# EAGLE design ArtNet_DMX_Controller (EAGLE 7.3.0)
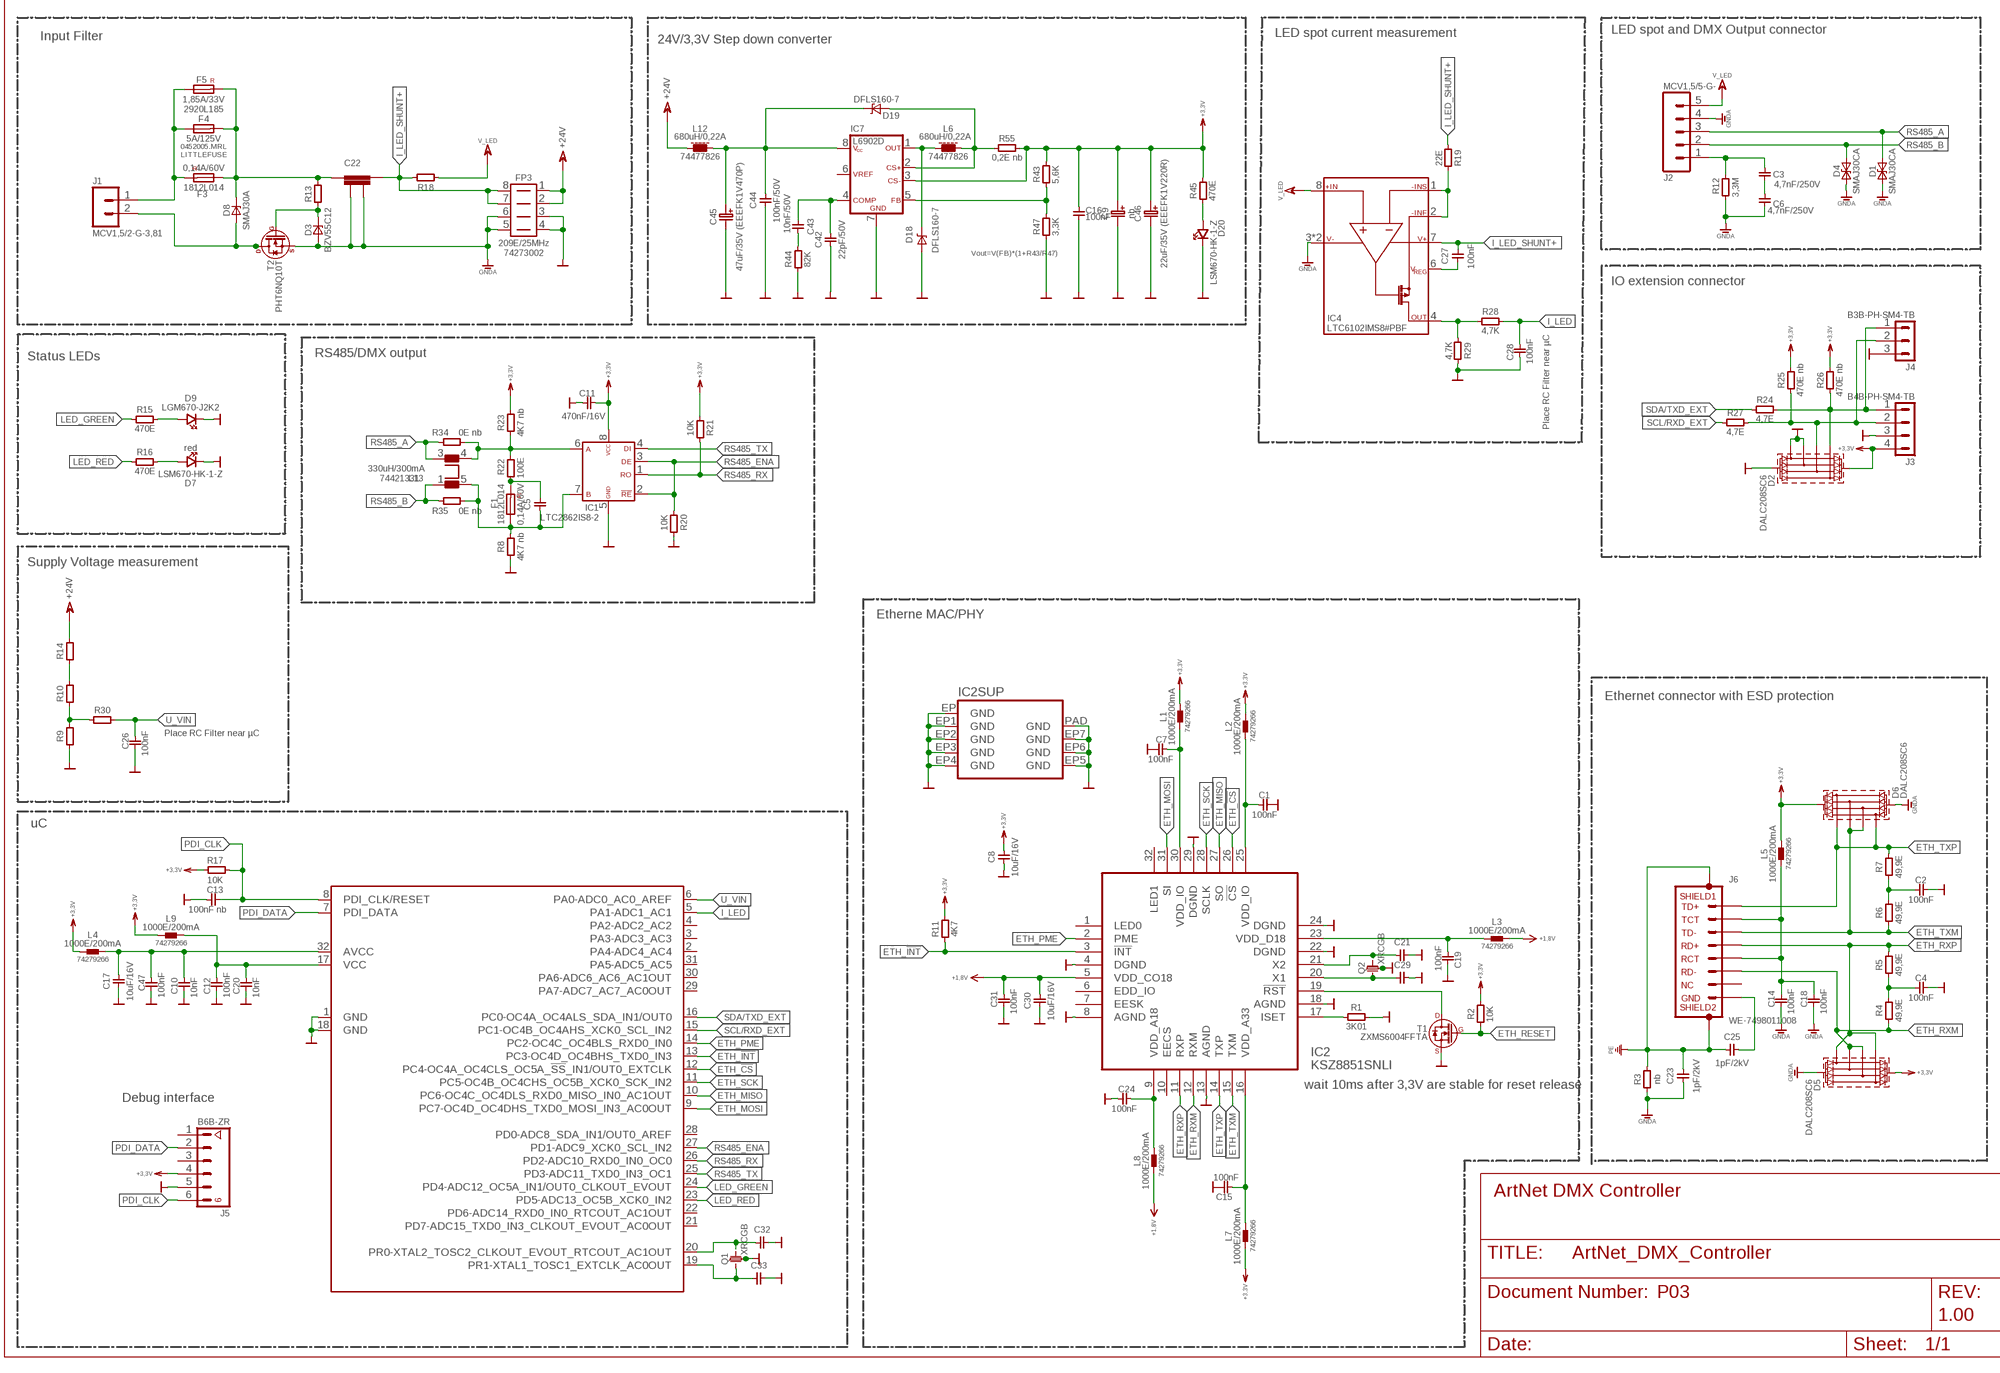
[diagram p0: schematic, sheet 1, part 1 of 2]
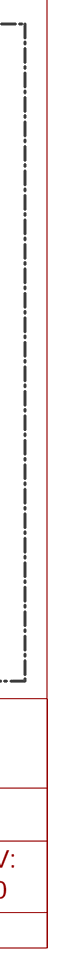
[diagram p1: schematic, sheet 1, part 2 of 2]

## Parts
C1  100nF  C-0603  [0603]
C2  100nF  C-0603  [0603]
C3  4,7nF/250V  C-2220  [2220]
C4  100nF  C-0603  [0603]
C5  C-0805  [0805]
C6  4,7nF/250V  C-2220  [2220]
C7  100nF  C-0603  [0603]
C8  10uF/16V  C-0805  [0805]
C9  nb  TANTAL-6032  [6032]
C10  10nF  C-0603  [0603]
C11  470nF/16V  C-0603  [0603]
C12  100nF  C-0603  [0603]
C13  100nF nb  C-0603  [0603]
C14  100nF  C-0603  [0603]
C15  100nF  C-0603  [0603]
C16  100nF  C-0603  [0603]
C17  10uF/16V  C-0805  [0805]
C18  100nF  C-0603  [0603]
C19  100nF  C-0603  [0603]
C20  10nF  C-0603  [0603]
C21  C-0603  [0603]
C22  NFM55P  [NFM55P]
C23  1pF/2kV  C-1206  [1206]
C24  100nF  C-0603  [0603]
C25  1pF/2kV  C-1206  [1206]
C26  100nF  C-0603  [0603]
C27  100nF  C-0805  [0805]
C28  100nF  C-0603  [0603]
C29  C-0603  [0603]
C30  10uF/16V  C-0805  [0805]
C31  100nF  C-0603  [0603]
C32  C-0603  [0603]
C33  C-0603  [0603]
C42  22pF/50V  C-0603  [0603]
C43  10nF/50V  C-0603  [0603]
C44  100nF/50V  C-0805  [0805]
C45  47uF/35V (EEEFK1V470P)  ELKO-PANSIZE-D  [PANASONIC-SIZE-CODE-D]
C46  22uF/35V (EEEFK1V220R)  ELKO-PANSIZE-D  [PANASONIC-SIZE-CODE-D]
C47  100nF  C-0603  [0603]
D1  SMAJ30CA  [DO-214AC]
D2  DALC208SC6  [SOT23-6L]
D3  BZV55C12  [SOD80C]
D4  SMAJ30CA  [DO-214AC]
D5  DALC208SC6  [SOT23-6L]
D6  DALC208SC6  [SOT23-6L]
D7  LSM670-HK-1-Z  [M670]
D8  SMAJ30A  [DO-214AC]
D9  LGM670-J2K2  [M670]
D18  DFLS160-7  [POWERDI123]
D19  DFLS160-7  [POWERDI123]
D20  LSM670-HK-1-Z  [M670]
F1  0,14A/60V  1812L014  [1812L]
F3  0,14A/60V  1812L014  [1812L]
F4  5A/125V  0452005.MRL  [6.1X2.69MM]
F5  1,85A/33V  2920L185  [2920L]
FP3  209E/25MHz  WE-MLS-209E/25MHZ-10,88MMX5,49MM  [WE-MLS-10,88MMX5,49MM]
IC1  LTC2862IS8-2  [SO8]
IC2  KSZ8851SNLI  IC_KSZ8851SNL  [QFN32_5X5]
IC3  E5-TQFP  [TQFP32]
IC4  LTC6102IMS8#PBF  [MS8]
IC7  L6902D  [SO8]
J1  MCV1,5/2-G-3,81  [MCV1,5/2-G-3,81]
J2  MCV1,5/5-G-  [MCV1,5/5-G-3,81_MOD]
J3  B4B-PH-SM4-TB  [B4B-PH-SM4-TB]
J4  B3B-PH-SM4-TB  [B3B-PH-SM4-TB]
J5  B6B-ZR  [B6B-ZR]
J6  WE-7498011008  [WE-749801108]
L1  1000E/200mA  WE-CBF-1000E/200MA-0603  [0603]
L2  1000E/200mA  WE-CBF-1000E/200MA-0603  [0603]
L3  1000E/200mA  WE-CBF-1000E/200MA-0603  [0603]
L4  1000E/200mA  WE-CBF-1000E/200MA-0603  [0603]
L5  1000E/200mA  WE-CBF-1000E/200MA-0603  [0603]
L6  680uH/0,22A  WE-PD-680UH/0,22A-7332  [73XX]
L7  1000E/200mA  WE-CBF-1000E/200MA-0603  [0603]
L8  1000E/200mA  WE-CBF-1000E/200MA-0603  [0603]
L9  1000E/200mA  WE-CBF-1000E/200MA-0603  [0603]
L12  680uH/0,22A  WE-PD-680UH/0,22A-7332  [73XX]
L13  330uH/300mA  WE-SL1-330UH/300MA  [WE-SL1]
Q1  XRCGB  [XRCGB]
Q2  XRCGB  [XRCGB]
R1  3K01  R-0603  [0603]
R2  10K  R-0603  [0603]
R3  nb  R-1206  [1206]
R4  49,9E  R-0603  [0603]
R5  49,9E  R-0603  [0603]
R6  49,9E  R-0603  [0603]
R7  49,9E  R-0603  [0603]
R8  4K7 nb  R-0805  [0805]
R9  R-0603  [0603]
R10  R-0603  [0603]
R11  4K7  R-0603  [0603]
R12  3,3M  R-0207  [0207]
R13  R-0805  [0805]
R14  R-0603  [0603]
R15  470E  R-0603  [0603]
R16  470E  R-0603  [0603]
R17  10K  R-0603  [0603]
R18  R-2512  [2512]
R19  22E  R-0603  [0603]
R20  10K  R-0603  [0603]
R21  10K  R-0603  [0603]
R22  100E  R-0207  [0207]
R23  4K7 nb  R-0805  [0805]
R24  4,7E  R-0603  [0603]
R25  470E nb  R-0603  [0603]
R26  470E nb  R-0603  [0603]
R27  4,7E  R-0603  [0603]
R28  4,7K  R-0603  [0603]
R29  4,7K  R-0603  [0603]
R30  R-0603  [0603]
R34  0E nb  R-0805  [0805]
R35  0E nb  R-0805  [0805]
R43  5,6K  R-0603  [0603]
R44  82K  R-0603  [0603]
R45  470E  R-0603  [0603]
R47  3,3K  R-0603  [0603]
R55  0,2E nb  R-0805  [0805]
T1  ZXMS6004FFTA  [SOT-23]
T2  PHT6NQ10T  [SOT223]

## Nets
+1,8V: C30.2 C31.2 IC2.5(VDD_CO18) L3.2 L8.1
+3,3V: C8.1 C9.PLUS(+) C11.2 C16.2 C46.+ D2.2(REF2) D5.2(REF2) D6.2(REF2) IC1.8(VCC) IC7.3(CS-) J3.4 J5.4 L1.2 L2.2 L4.1 L5.2 L7.1 L9.1 R2.2 R11.2 R17.2 R21.2 R23.2 R25.2 R26.2 R43.2 R45.2 R55.2
+24V: FP3.1 FP3.2 L12.1 R14.2
AVCC: C10.2 C17.2 C47.2 IC3.32(AVCC) L4.2
BLA: C5.1 F1.1 IC1.7(B) L13.5 R8.2 R35.2
BLA2: IC1.6(A) L13.4 R22.2 R23.1 R34.2
ETH_!CS: IC2.26(!CS) IC3.12(PC4-OC4A_OC4CLS_OC5A_!SS!_IN1/OUT0_EXTCLK)
ETH_!INT: IC2.3(!INT) IC3.13(PC3-OC4D_OC4BHS_TXD0_IN3) R11.1
ETH_MISO: IC2.27(SO) IC3.10(PC6-OC4C_OC4DLS_RXD0_MISO_IN0_AC1OUT)
ETH_MOSI: IC2.31(SI) IC3.9(PC7-OC4D_OC4DHS_TXD0_MOSI_IN3_AC0OUT)
ETH_PME: IC2.2(PME) IC3.14(PC2-OC4C_OC4BLS_RXD0_IN0)
ETH_RESET: R2.1 T1.1(G)
ETH_RXM: D5.3(I/O2) D5.4(I/O3) IC2.12(RXM) J6.P$6(RD-) R4.1
ETH_RXP: D5.1(I/O1) D5.6(I/O4) IC2.11(RXP) J6.P$3(RD+) R5.2
ETH_SCK: IC2.28(SCLK) IC3.11(PC5-OC4B_OC4CHS_OC5B_XCK0_SCK_IN2)
ETH_TXM: D6.3(I/O2) D6.4(I/O3) IC2.15(TXM) J6.P$2(TD-) R6.1
ETH_TXP: D6.1(I/O1) D6.6(I/O4) IC2.14(TXP) J6.P$1(TD+) R7.2
GND: C1.2 C2.2 C4.2 C7.2 C8.2 C9.MINUS(-) C10.1 C11.1 C12.1 C13.2 C15.2 C16.1 C17.1 C19.2 C20.1 C21.2 C24.1 C26.1 C28.1 C29.2 C30.1 C31.1 C32.2 C33.2 C42.1 C44.1 C45.- C46.- C47.1 D2.1(I/O1) D2.3(I/O2) D2.5(REF1) D7.K D9.K D18.A D20.K FP3.3 FP3.4 IC1.5(GND) IC2.4(DGND) IC2.8(AGND) IC2.13(AGND) IC2.18(AGND) IC2.22(DGND) IC2.24(DGND) IC2.29(DGND) IC2.EP1(GND) IC2.EP2(GND) IC2.EP3(GND) IC2.EP4(GND) IC2.EP5(GND) IC2.EP6(GND) IC2.EP7(GND) IC2.EP(GND) IC2.PAD(GND) IC3.1(GND) IC3.18(GND) IC7.7(GND) J3.3 J4.3 J5.5 Q1.3 Q1.4 Q2.3 Q2.4 R1.2 R8.1 R9.1 R20.1 R29.2 R44.1 R47.1 T1.2(S)
GNDA: C6.P$1 C14.1 C18.1 C22.3 C22.4 C23.1 D1.K D3.A D4.K D5.5(REF1) D6.5(REF1) FP3.5 FP3.6 IC4.3(V-) IC4.5(V-) J2.4 R3.1 R12.1 T2.3(S)
I_LED: C28.2 IC3.5(PA1-ADC1_AC1) R28.2
I_LED_SHUNT+: C22.2 C27.2 FP3.7 FP3.8 IC4.7(V+) R18.2 R19.1
LED_GREEN: IC3.24(PD4-ADC12_OC5A_IN1/OUT0_CLKOUT_EVOUT) R15.1
LED_RED: IC3.23(PD5-ADC13_OC5B_XCK0_IN2) R16.1
N$1: IC2.17(ISET) R1.1
N$2: C3.P$2 J2.1 R12.2
N$3: IC2.19(!RST) T1.3(D)
N$4: C7.1 IC2.30(VDD_IO) L1.1
N$5: C1.1 IC2.25(VDD_IO) L2.1
N$6: C5.2 F1.2 R22.1
N$7: D3.K R13.1 T2.1(G)
N$8: C27.1 IC4.6(VREG)
N$9: C3.P$1 C6.P$2
N$10: C25.2 J6.P$8(GND)
N$11: D9.A R15.2
N$12: D7.A R16.2
N$13: C29.1 IC2.20(X1) Q2.1
N$14: C32.1 IC3.20(PR0-XTAL2_TOSC2_CLKOUT_EVOUT_RTCOUT_AC1OUT) Q1.2
N$15: F3.2 F4.1 F5.1 J1.1
N$16: C33.1 IC3.19(PR1-XTAL1_TOSC1_EXTCLK_AC0OUT) Q1.1
N$17: R10.2 R14.1
N$18: IC4.4(OUT) R28.1 R29.1
N$19: C22.1 D8.K F3.1 F4.2 F5.2 R13.2
N$20: C15.1 IC2.16(VDD_A33) L7.2
N$21: R9.2 R10.1 R30.1
N$22: D2.6(I/O4) J3.1 J4.1 R24.2 R26.1
N$23: C21.1 IC2.21(X2) Q2.2
N$24: D2.4(I/O3) J3.2 J4.2 R25.1 R27.2
N$25: C14.2 C18.2 J6.P$4(TCT) J6.P$5(RCT) L5.1
N$26: C2.1 R6.2 R7.1
N$27: C24.2 IC2.9(VDD_A18) L8.2
N$28: D8.A J1.2 T2.2(D) T2.4(D1)
N$29: C4.1 R4.2 R5.1
N$30: IC4.1(-INS) IC4.2(-INF) R19.2
N$38: IC7.5(FB) R43.1 R47.2
N$39: D19.A IC7.2(CS+) L6.2 R55.1
N$59: D18.K IC7.1(OUT) L6.1
N$62: C42.2 C43.1 IC7.4(COMP)
N$63: C43.2 R44.2
N$65: D20.A R45.1
N$67: C44.2 C45.+ D19.K IC7.8(VCC) L12.2
PDI_CLK: C13.1 IC3.8(PDI_CLK/RESET) J5.6 R17.1
PDI_DATA: IC3.7(PDI_DATA) J5.2
PE: C23.2 C25.1 J6.P$9 J6.P$10 R3.2
RS485_A: D1.A J2.3 L13.3 R34.1
RS485_B: D4.A J2.2 L13.1 R35.1
RS485_ENA: IC1.2(/RE) IC1.3(DE) IC3.27(PD1-ADC9_XCK0_SCL_IN2) R20.2
RS485_RX: IC1.1(R0) IC3.26(PD2-ADC10_RXD0_IN0_OC0) R21.1
RS485_TX: IC1.4(DI) IC3.25(PD3-ADC11_TXD0_IN3_OC1)
SCL/RXD_EXT: IC3.15(PC1-OC4B_OC4AHS_XCK0_SCL_IN2) R27.1
SDA/TXD_EXT: IC3.16(PC0-OC4A_OC4ALS_SDA_IN1/OUT0) R24.1
U_VIN: C26.2 IC3.6(PA0-ADC0_AC0_AREF) R30.2
V_LED: IC4.8(+IN) J2.5 R18.1
VCC: C12.2 C20.2 IC3.17(VCC) L9.2
VDD_D18: C19.1 IC2.23(VDD_D18) L3.1
Unconnected: IC2.1(LED0) IC2.6(EDD_IO) IC2.7(EESK) IC2.10(EECS) IC2.32(LED1) IC3.2(PA4-ADC4_AC4) IC3.3(PA3-ADC3_AC3) IC3.4(PA2-ADC2_AC2) IC3.21(PD7-ADC15_TXD0_IN3_CLKOUT_EVOUT_AC0OUT) IC3.22(PD6-ADC14_RXD0_IN0_RTCOUT_AC1OUT) IC3.28(PD0-ADC8_SDA_IN1/OUT0_AREF) IC3.29(PA7-ADC7_AC7_AC0OUT) IC3.30(PA6-ADC6_AC6_AC1OUT) IC3.31(PA5-ADC5_AC5) IC7.6(VREF) J5.1 J5.3 J6.P$7(NC)

## Notes on the sheet
- LED spot current measurement | LED spot and DMX Output connector
- Input Filter | 24V/3,3V Step down converter
- Vout=V(FB)*(1+R43/R47)
- IO extension connector
- Place RC Filter near µC
- Status LEDs | RS485/DMX output
- Supply Voltage measurement
- Etherne MAC/PHY
- Ethernet connector with ESD protection
- Place RC Filter near µC
- uC
- wait 10ms after 3,3V are stable for reset release
- Debug interface
- ArtNet DMX Controller
- P03
- 1.00

## Library data of the parts
C1 C2 C4 C7 C10-C16 C18-C21 C24 C26 C28 C29 C31-C33 C42 C43 C47 = 110_PASSIV:C: PASSIVE - Bauelement C; HEIGHT: 0.3
C3 C6 = 110_PASSIV:C: PASSIVE - Bauelement C
C5 C8 C17 C23 C25 C27 C30 C44 = 110_PASSIV:C: PASSIVE - Bauelement C; HEIGHT: 0.85
C9 = 110_PASSIV:TANTAL
C22 = 110_PASSIV:NFM?: EMIFIL (Capacitor type) Single Circuit Type for Large Current Infos ID-number: S37144 ... ... Table of revision Date Name Description 20.09.2010 EBBE erstellt ... ... ... ... ... ...
C45 C46 = 110_PASSIV:ELKO: ALUMINUM ELECTROLYTIC CAPACITORS
D1 D4 = 100_DIODE:SMAJ*CA: Transient Voltage Suppressors - SMAJ Series Bild/ Picture Merkmale/ Features Low profile package Ideal for automated placement Excellent clamping capability 400W peak pulse power capability with a 10/1000µs waveform, repetitive rate (duty cycle): 0,01% (300W above 78V) Very fast response time Anwendungen/ Applications TVS devices are ideal for protection of I/O Interfaces, VCC bus and other vulnerable circuits used in Telecom, Computer, Industrial and Consumer electronic applications. Beschreibung/ Description The SMAJ series is designed specifically to protect sensitive electronic equipment from voltage transients induced by lightning and other transient voltage events. Link Datenblatt - Vishay <http://www.vishay.com/docs/88390/smaj50a.pdf> Datenblatt - Littelfuse <http://www.littelfuse.com/products/tvs-diodes/surface-mount/~/media/Electronics/Datasheets/TVS_Diodes/Littelfuse_TVS_Diode_SMAJ_Datasheet.pdf.pdf> Datenblatt - ST <http://www.st.com/st-web-ui/static/active/en/resource/technical/document/datasheet/CD00001333.pdf> EBBE, 27.11.2013; DE-ID: 47526; HEIGHT: 2,45; I_PP: 8,3A; V_BR-MAX: 36,8V; V_BR-MIN: 33,3V; V_CL: 48,4V
D2 D5 D6 = 100_DIODE:DALC208SC6: DALC208SC6 - low capacitance diode array (ESD) Manufacturer: ST Id: 52398 Features: protection of 4 lines peak reverse voltage: 9V per diode very low capacitance per diode: lower 5pF Main applications: sensitive logic input protection ISDN USB interface Networks SMAN (sman@diel.co.at) Updated 11/11/2009
D3 = 100_DIODE:BZ?55C*: BZV55: Features Non-repetitive peak reverse power dissipation: lower equal 40W Total power dissipation: lower equal 500mW Two tolerance series: +/-2% and +/-5% Wide working voltage range: nominal 2.4V to 75V (E24 range) Low differential resistance Small hermetically sealed glass SMD package Applications General regulation functions autor: EBBE BZM55: Features: Saving space Electrical data identical with the devices BZT55..Series / TZM..Series Fits onto SOD323/SOD110 footprints Very sharp reverse characteristic Low reverse current level Very high stability Low noise Available with tighter tolerances Lead (Pb)-free component Component in accordance to RoHS 2002/95/EC and WEEE 2002/96/EC Applications Voltage stabilization autor: EBBE
D7 D20 = 130_OPTIC:L?M670*: Mini TOPLED von SIEMENS Infos LSM670-HK-1-Z ROT clear S34264 LGM670-J2K2 GRÜN clear S34262 LPM670-H1J11 GRÜN S50228 LYM670-HK GELB S42944 --> abgekündigt! Alternative: 58419 LYM67K-K1L2 Table of revision Date Name Description ? LETI erstellt 29.04.2010 SMAN Description ... ... ...; COLOR: red; HEIGHT: 1,4
D8 = 100_DIODE:SMAJ*A: Transient Voltage Suppressors - SMAJ Series Bild/ Picture Merkmale/ Features Low profile package Ideal for automated placement Excellent clamping capability 400W peak pulse power capability with a 10/1000µs waveform, repetitive rate (duty cycle): 0,01% (300W above 78V) Very fast response time Anwendungen/ Applications TVS devices are ideal for protection of I/O Interfaces, VCC bus and other vulnerable circuits used in Telecom, Computer, Industrial and Consumer electronic applications. Beschreibung/ Description The SMAJ series is designed specifically to protect sensitive electronic equipment from voltage transients induced by lightning and other transient voltage events. Link Datenblatt - Vishay <http://www.vishay.com/docs/88390/smaj50a.pdf> Datenblatt - Littelfuse <http://www.littelfuse.com/products/tvs-diodes/surface-mount/~/media/Electronics/Datasheets/TVS_Diodes/Littelfuse_TVS_Diode_SMAJ_Datasheet.pdf.pdf> Datenblatt - ST <http://www.st.com/st-web-ui/static/active/en/resource/technical/document/datasheet/CD00001333.pdf> EBBE, 27.11.2013; DE-ID: 47526; HEIGHT: 2.3; I_PP: 8,3A; V_BR-MAX: 36,8V; V_BR-MIN: 33,3V; V_CL: 48,4V
D9 = 130_OPTIC:L?M670*: Mini TOPLED von SIEMENS Infos LSM670-HK-1-Z ROT clear S34264 LGM670-J2K2 GRÜN clear S34262 LPM670-H1J11 GRÜN S50228 LYM670-HK GELB S42944 --> abgekündigt! Alternative: 58419 LYM67K-K1L2 Table of revision Date Name Description ? LETI erstellt 29.04.2010 SMAN Description ... ... ...; COLOR: green; HEIGHT: 1,4
D18 D19 = 100_DIODE:DFLS160-7: 1.0A Surface Mount Schottky Barrier Rectifier Hersteller DIODES Reverse Voltage 70V Feature Guard Ring Die Construction for Transient Protection Low Power Loss, High Efficiency Patented Interlocking Clip Design for High Surge Current Capacity Lead-free Finish; RoHS Compliant (Notes 1&2) Green Molding Compound (No Br, Sb) Qualified to AEC-Q101 Standards for High Reliability PDF Datenblatt Herstellerseite Web <http://www.diodes.com/datasheets/ds30548.pdf> EBBE, 02.10.2012; HEIGHT: 1
F1 F3 = 150_FUSES:1812L*: 1812L Series < POLY-FUSE Resettable PTCs Bild/ Picture Merkmale/ Features RoHS compliant, lead-free and halogen-free Fast response Compact design Low resistance Low-profile Compatible with high temperature solders Anwendungen/ Applications --- Beschreibung/ Description The 1812L Series PTC provides surface mount overcurrent protection for applications where resettable protection is desired. Link Datenblatt <http://www.littelfuse.com/products/resettable-ptcs/surface-mount/~/media/Electronics/Datasheets/Resettable_PTCs/Littelfuse_PTC_1812L_Datasheet.pdf.pdf> EBBE, 27.11.2013 update LETI, 16.10.2014 (1812L014); DE-ID: 48868; HEIGHT: 1.95; MPN: 1812L014; RESISTANCE-MAX: 6E; RESISTANCE-MIN: 1,5E
F4 = 150_FUSES:0452*MRL: 452/454 Series < Slo-Blo < NANO² Bild/ Picture Merkmale/ Features Time-Lag (Slo-Blo) Small size Wide range of current rating available (375mA to 12A) Wide operating temperature range Low temperature de-rating RoHS compliant Halogen Free Anwendungen/ Applications --- Beschreibung/ Description The NANO² Slo-Blo fuse has enhanced inrush withstand chracteristics over the NANO² Fast-Acting fuse. The unique time delay feature of this fuse design helps solve the problem of nuisance "opening" by accommodating inrush currents that normaly cause a fast-acting fuse to open. Link Datenblatt <http://www.littelfuse.com/products/fuses/surface-mount-fuses/nano-2-fuses/~/media/Electronics/Datasheets/Fuses/Littelfuse_Fuse_452_454_Datasheet.pdf.pdf> - 452/454 Series EBBE, 25.11.2013; DE-ID: 74866; MF: LITTLEFUSE; MPN: 0452005.MRL; NOMINAL-MELTING: 53,72A²sec; RESISTANCE: 0,0136E
F5 = 150_FUSES:2920L*: 2920L Series < POLY-FUSE Resettable PTCs Bild/ Picture Merkmale/ Features RoHS compliant, lead-free and halogen-free Fast response to fault currents High voltage Low-profile Anwendungen/ Applications --- Beschreibung/ Description The 2920L Series PTC provides surface mount overcurrent protection for medium voltage (≤60V) applications where resettable protection is desired. Link Datenblatt <http://www.littelfuse.com/~/media/electronics/datasheets/resettable_ptcs/littelfuse_ptc_2920l_datasheet.pdf.pdf> EBBE, 25.11.2013; DE-ID: 45675; HEIGHT: 1.25; MPN: 2920L185; RESISTANCE-MAX: 0,15E; RESISTANCE-MIN: 0,05E; RESISTANCE-TYP: 0,11E
FP3 = 220_WUERTH:WE-MLS: WE-MLS Ferritbrücke Bild/ Picture Merkmale/ Features Zweifach stromkempensierte Drossel durch Verschaltung zu 2x2 Windungen erzeugbar Hohe Strombelastbarkeit von typ. 4A Breitbandige Filterwirkung durch NiZn-Absorberferritkern HF-Gleichtaktdrossel für 2, 3 bzw. 4 Leitungen in einem Bauteil Durch entsprechende Layoutgestaltung lässt sich Impedanz (z.B. 4 Windungen) bzw. Strom erhöhen (Parallelschaltung) Betriebstemperatur: –55 °C bis +125 °C Kundenspezifische Ausführungen auf Anfrage Anwendungen/ Applications Hervorragend geeignet zur Absorption von Gleich- und Gegentaktstörungen Bei einfacher Durchführung entsteht für das Signal eine stromkompensierte 3- bzw. 4- fach-Drossel Mehrleitersysteme und Leistungselektronik Befilterung von Kleinspannungsnetzteilen 4- Leiter Sensorik Beschreibung/ Description --- Link Datenblatt <http://katalog.we-online.de/de/pbs/WE-MLS> EBBE, 21.10.2013; DE-ID: 87706; MPN: 74273002; Z-100MHZ: 249E
IC1 = 260_LINEAR_TECHNOLOGY:LTC2862*?-2: ±60V Fault Protected 3V to 5.5V RS485/RS422 Transceivers Bild/ Picture Merkmale/ Features Protected from Overvoltage Line Faults to ±60V 3V to 5.5V Supply Voltage 20Mbps or Low EMI 250kbps Data Rate ±15kV ESD Interface Pins, ±8kV All Other Pins Extended Common Mode Range: ±25V Guaranteed Failsafe Receiver Operation High Input Impedance Supports 256 Nodes 1.65V to 5.5V Logic Supply Pin (VL) for Flexible Digital Interface (LTC2865) MP-Grade Option Available (–55°C to 125°C) Fully Balanced Differential Receiver Thresholds for Low Duty Cycle Distortion Current Limited Drivers and Thermal Shutdown Pin Compatible with LT1785 and LT1791 Available in DFN and Leaded Packages Anwendungen/ Applications Supervisory Control and Data Acquisition (SCADA) Industrial Control and Instrumentation Networks Automotive and Transportation Electronics Building Automation, Security Systems and HVAC Medical Equipment Lighting and Sound System Control Beschreibung/ Description The LT C®2862/LTC2863/LTC2864/LTC2865 are low power, 20Mbps or 250kbps RS485/RS422 transceivers operating on 3V to 5.5V supplies that feature ±60V overvoltage fault protection on the data transmission lines during all modes of operation, including power-down. Low EMI slew rate limited data transmission is available in a logic-selectable 250kbps mode in the LTC2865 and in 250kbps versions of the LTC2862-LTC2864. Enhanced ESD protection allows these parts to withstand ±15kV HBM on the transceiver interface pins without latchup or damage. Extended ±25V input common mode range and full fail- safe operation improve data communication reliability in electrically noisy environments and in the presence of large ground loop voltages. Link Datenblatt <http://cds.linear.com/docs/en/datasheet/2862345fb.pdf> update LETI, 18.03.2014; HEIGHT: 1.752; HERSTELLER: Liniar Technology; ID: 91903; K: S; MPN: LTC2862IS8-2#TRPBF
IC2 = dp_devices:IC_KSZ8851SNL: Fast Ethernet Controller with PHY, MAC and SPI
IC3 = e5:E5
IC4 = 260_LINEAR_TECHNOLOGY:LTC6102*?#PBF: Precision Zero Drift Current Sense Amplifier Merkmale/ Features Supply Range: 4V to 60V, 70V Maximum (LTC6102) 5V to 100V, 105V Maximum (LTC6102HV) ±10µV Input Offset Maximum ±50nV/°C Input Offset Drift Maximum Fast Response: 1µs Step Response Gain Configurable with Two Resistors Low Input Bias Current: 3nA Maximum PSRR 130dB Minimum Output Currents up to 1mA Operating Temperature Range: -40°C to 125°C Disable Mode (LTC6102-1 Only): 1µA Maximum Available in 8-Lead MSOP and 3mm x 3mm DFN Packages Anwendungen/ Applications Current Shunt Measurement Battery Monitoring Remote Sensing Load Protection Motor Control Automotive Controls Link Datenblatt <http://cds.linear.com/docs/en/datasheet/6102fe.pdf> EBBE, 04.06.2014; DE-ID: ---
IC7 = 120_AKTIV:L6902D: Up to 1A switching regulator with adjustable current limit Hersteller ST Microelectronics Feature Up to 1A output current Operating input voltage from 8V to 36V Precise 3,3V (+/-2%) reference voltage 5% output current accuracy Output voltage adjustable from 1.235V to 34V 250kHz internally fixed frequency Voltage feedforward Zero load current operation Adjustable current limit Protection against feedback Disconnection Thermal shutdown PDF Datenblatt Herstellerseite Web <http://www.st.com/internet/com/TECHNICAL_RESOURCES/TECHNICAL_LITERATURE/DATASHEET/CD00002179.pdf> EBBE, 08.02.2013
J1 = 370_PHOENIX:MCV1,5/2-G-3,81: 1803426 MCV 1,5/2-G-3,81 SMAN, 20.12.2012; HEIGHT: 9.2
J2 = 370_PHOENIX:MCV1,5/5-G-?: 5-polige Phoenix Buchse Infos Schlagwörter: Phoenix Buchse Id's: Fxxxxx Änderungsverzeichnis Date Name Description 07.03.2011 EBBE erstellt ... ... ... ... ... ...
J3 = 310_JST:?4B-PH-SM4*-TB: PH Connector Specifications Rastermaß: 2mm Current rating: 2.0A AC, DC (AWG #24) Voltage rating: 100V AC, DC Temperature range: -25°C to 85°C AWG #32 to #24 Id's B4B-PH-SM4-TB S44350 S4B-PH-SM4A-TB S35132 SPH-002T-P0.5S: F04117 (AWG #30 to #24) PHR-04: F04494 Autor: LETI
J4 = 310_JST:?3B-PH-SM4*-TB: PH Connector Specifications Rastermaß: 2mm Current rating: 2.0A AC, DC (AWG #24) Voltage rating: 100V AC, DC Temperature range: -25°C to 85°C AWG #32 to #24 Id's B3B-PH-SM4-TB: S25304 S3B-PH-SM4-TB: S52351 SPH-002T-P0.5S: F04117 (AWG #30 to #24) PHR-03: F16605 Autor: EBBE
J5 = 310_JST:?6B-ZR
J6 = RJ45:WE-7498011008
L1-L5 L7-L9 = 220_WUERTH:WE-CBF: WE-CBF SMD EMI Suppression Ferrite Bead Bild/ Picture Merkmale/ Features Hochwertige Ni-Sn Elektroden Sehr hohe Stromtragfähigkeit bis 6A Empfohlenes Lötverfahren: Reflow Betriebstemperatur: -55°C bis +125°C Anwendungen/ Applications Ideal als Datenleitungsfilter und zur Versorgungsspannungsentkopplung Beschreibung/ Description Die speziellen Miniatur-SMD-Ferrite in Multilayertechnik werden direkt auf die Platine gelötet. Sie besitzen sehr gute Filtereigenschaften und einen geringen Gleichstrom-Widerstand. Nahe an der Störquelle platziert, können selbst bei kleinster Bauform 0402, maximale Impedanzen um 1000 Ω erzielt werden. Link Datenblatt <http://katalog.we-online.de/de/pbs/WE-CBF> EBBE, 17.10.2013; DE-ID: 57166; HEIGHT: 0.8; I-R: 200mA; MPN: 74279266; R-DC: 0,6E; TC_Z-MAX: 140MHz; Z-100MHZ: 1000E; Z-MAX: 1350E
L6 L12 = 220_WUERTH:WE-PD: WE-PD SMD-Speicherdrossel Bild/ Picture Merkmale/ Features Um eine bessere Lichtausbeute bei LED Applikationen zu erhalten hat Würth Elektronik nun auch die WE-PD in weiß in das Produktspektrum aufgenommen. Somit ist ein optisch ansprechenderes Design möglich, da neben der Platine nun auch darauf befindliche Bauteile in weiß gefertigt werden können. Auf Anfrage erhalten Sie die SMD-Speicherdrossel in den Bauformen 7332, 7345, 1210 und 1280 (alle mit Kunstoffbase) in weißer Ausführung. Höchstmögliche Strombelastbarkeit für SMD-Drosseln Magnetisch geschirmt, d.h. geringes Streufeld Hohe Speicherfähigkeit Geringe Eigenverluste Betriebstemperatur: –40 °C bis +125 °C Empfohlenes Lötverfahren: Reflow Anwendungen/ Applications Schaltregler im Bereich kleiner Betriebsspannungen (Computer, Laptop, Mobilfunk, Pager) Integrierte DC-/DC-Wandler Ideal für Schaltregler mit extrem hohem Wirkungsgrad (>86%) Grafikklarten, embedded PC-Karten Kunststoffbase: Aufgrund der verbesserten Konstruktion sind diese bevorzugt bei vibrations- und schockbeanspruchten Applikationen zu empfehlen Beschreibung/ Description Die Umgebungstemperatur beim Betrieb der Speicherdrosseln der Serie WE-PD bei voller Nennstrombelastung darf standardmäßig von -40°C bis zu +85°C betragen. Bei höheren Umgebungstemperaturen muss die Eigenerwärmung des Bauteils beachtet werden, um die zulässige Lötstellentemperatur nicht zu überschreiten, bzw. die Isolation des Drahtes zu beschädigen. Der verwendete Draht weist eine Temperaturbeständigkeit von bis zu +150°C auf. Der Ferritkern selbst ist über einen viel größeren Temperaturbereich (ca. -50°C bis +250°C (Curietemperatur)) einsetzbar. Allerdings können hier aufgrund der temperaturabhängigen Permeabilität die Toleranzgrenzen der Induktivität verlassen werden. Link Datenblatt <http://katalog.we-online.de/de/pbs/WE-PD> EBBE, 22.10.2013; DE-ID: 90766; F-RES: 3MHz; HEIGHT: 3.2; I-SAT: 0,22A; MPN: 74477826; R-DC: 5,73E; R-DC_TYP: 4,5E
L13 = 220_WUERTH:WE-SL1: WE-SL1 Stromkompensierter SMD Line Filter Bild/ Picture Merkmale/ Features Geringe Bauhöhe, nur 1,65mm Strombelastbarkeit bis 300mA Betriebstemperatur: –40 °C bis +105 °C Betriebsspannung: 80VDC (42VAC) Empfohlenes Lötverfahren: Reflow Anwendungen/ Applications USB CAN Firewire Datenleitungen Spannungsversorgung Messsignal-Leitung/Sensorleitung Unterdrückung von Gleichtaktstörung Beschreibung/ Description --- Link Datenblatt <http://katalog.we-online.de/de/pbs/WE-SL1> EBBE, 23.10.2013; DE-ID: 65007; MPN: 74421331; R-DC: 0,3E; U-R: 80V; U-T: 250VAC; WICKLUNGSTECHNIK: sektionell; Z: 2000E
Q1 Q2 = oscillator:XRCGB
R1 R2 R4-R7 R9-R11 R14-R17 R19-R21 R24-R30 R43-R45 R47 = 110_PASSIV:R: PASSIVE - Bauelemente R; HEIGHT: 0.6
R3 = 110_PASSIV:R: PASSIVE - Bauelemente R
R8 R13 R23 R34 R35 R55 = 110_PASSIV:R: PASSIVE - Bauelemente R; HEIGHT: 0.85
R12 R22 = 110_PASSIV:R: PASSIVE - Bauelemente R; HEIGHT: 2.6
R18 = 110_PASSIV:R: PASSIVE - Bauelemente R; HEIGHT: 0.8
T1 = 080_N-FET:ZXMS6004?TA: 60V N-CHANNEL SELF PROTECTED ENHANCEMENT MODE INTELLIFET™ MOSFET Bild/ Picture Merkmale/ Features Compact high power dissipation package Low input current Logic Level Input (3.3V and 5V) Short circuit protection with auto restart Over voltage protection (active clamp) Thermal shutdown with auto restart Over-current protection Input Protection (ESD) High continuous current rating Totally Lead-Free & Fully RoHS compliant (Notes 1 & 2) Halogen and Antimony Free. “Green” Device (Note 3) Qualified to AEC-Q101 Standards for High Reliability Anwendungen/ Applications Especially suited for loads with a high in-rush current such as lamps and motors All types of resistive, inductiveand capacitive loads in switching applications μC compatible power switch for 12V and 24V DC applications Automotive rated Replaces electromechanicalrelays and discrete circuits Linear Mode capability - the current-limiting protection circuitry is designed to de-activate at low VDS to minimize on state power dissipation. The maximum DC operating current is therefore determined by the thermal capability of the package/board combination, rather than by the protection circuitry. This does not compromise the product’s ability to self-protect at low VDS. Beschreibung/ Description The ZXMS6004FF is a self protected low side MOSFET with logic level input. It integrates over-temperature, over-current, over-voltage (active clamp) and ESD protected logic level functionality. The ZXMS6004FF is ideal as a general purpose switch driven from 3.3V or 5V microcontrollers in harsh environments where standard MOSFETs are not rugged enough. Link Datenblatt <http://diodes.com/datasheets/ZXMS6004FF.pdf> LETI, 26.09.2014; HEIGHT: 1
T2 = 350_PHILIPS_NXP:PHT6NQ10T: PHT6NQ10T - N-channel TrenchMOS transistor Infos ... ... ... ... Table of revision Date Name Description 25.11.2010 EBBE erstellt ... ... ... ... ... ...

## Board
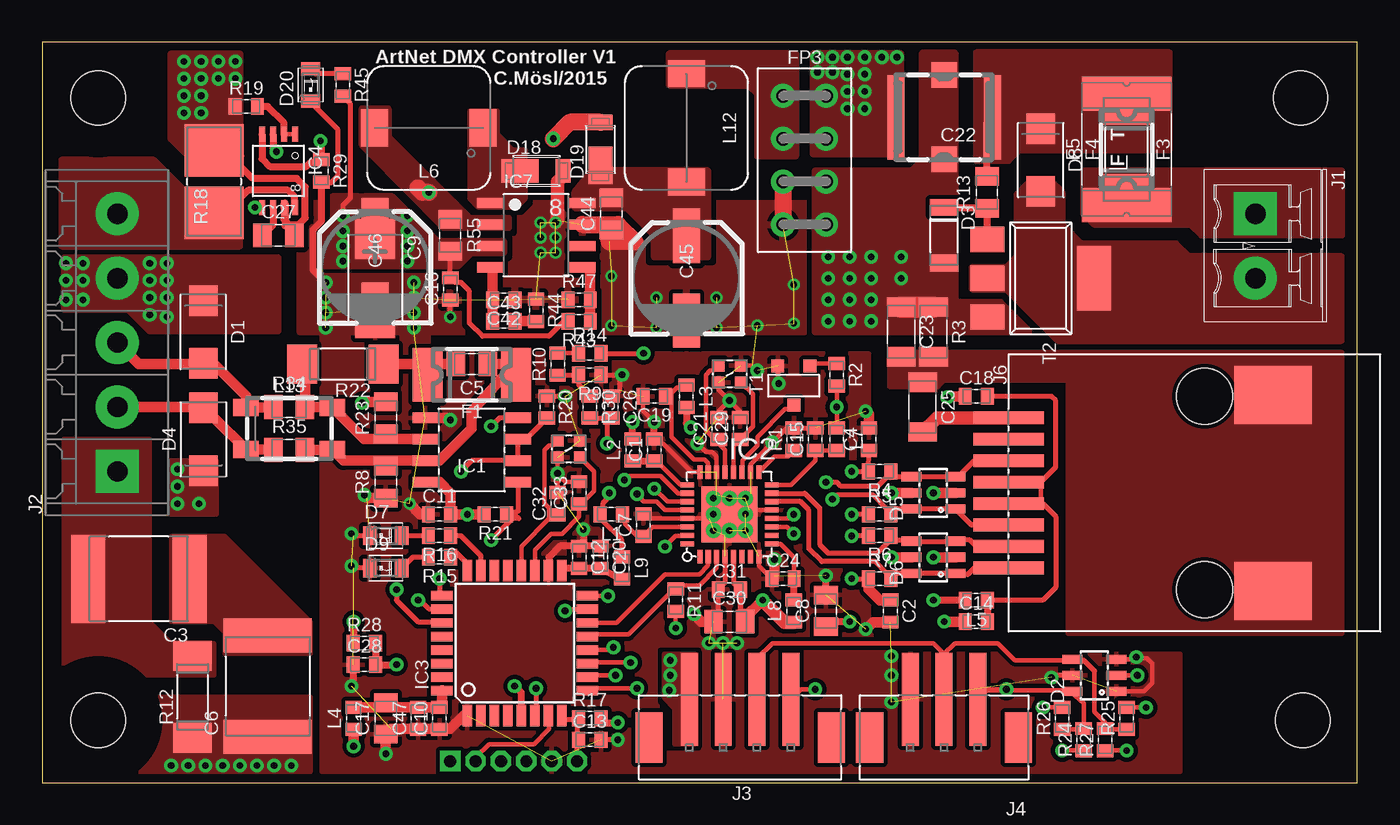
[diagram p2: board, top side]
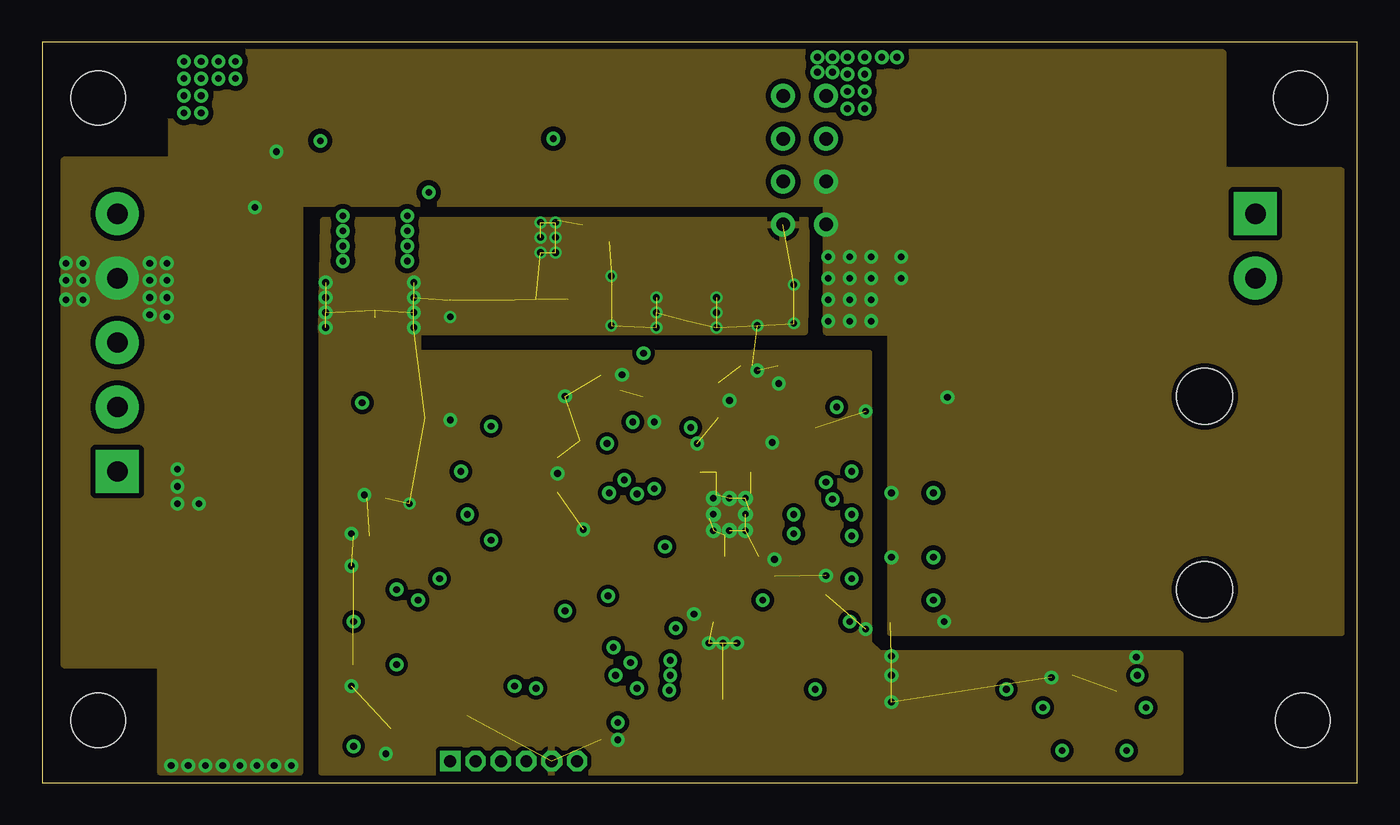
[diagram p3: board, inner layer GND]
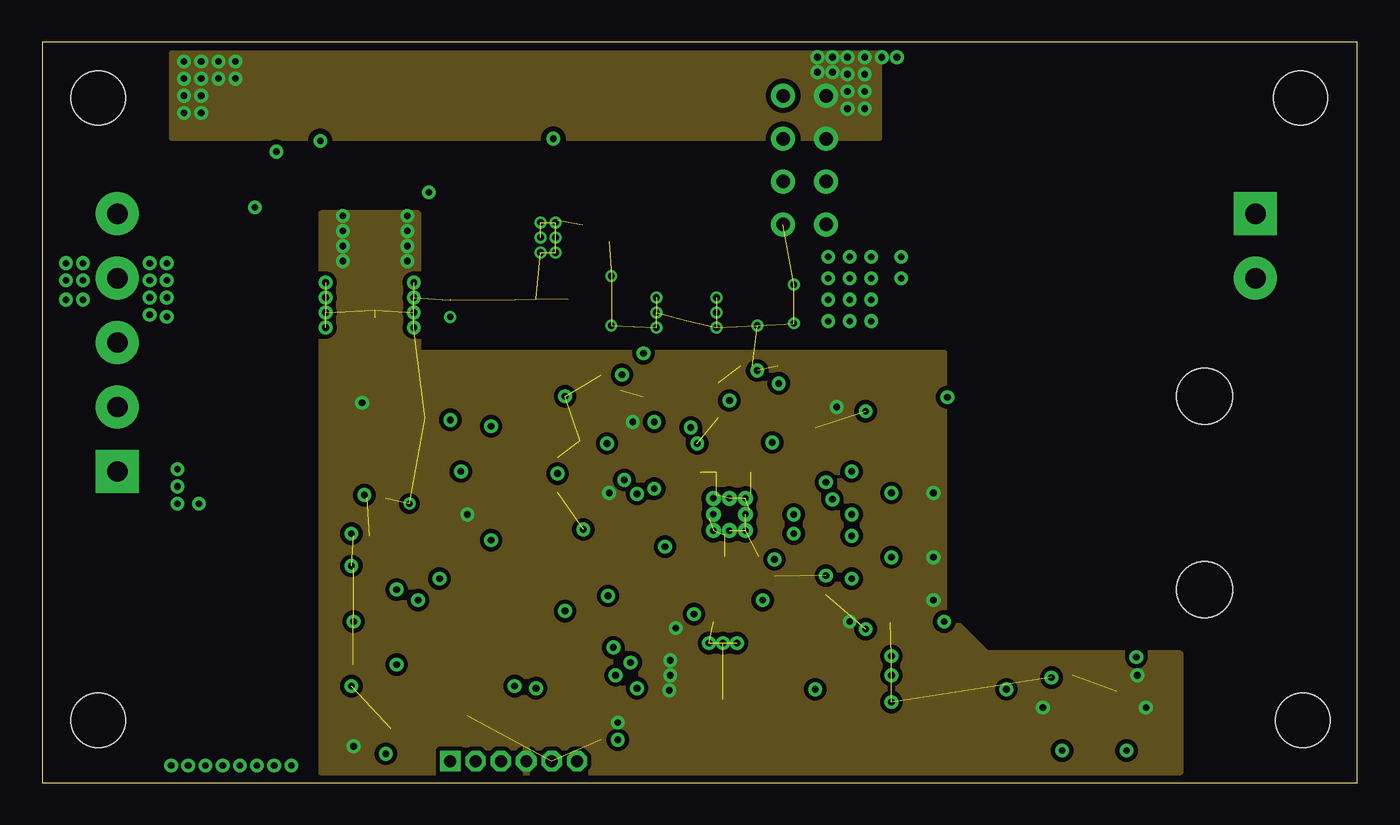
[diagram p4: board, inner layer VCC]
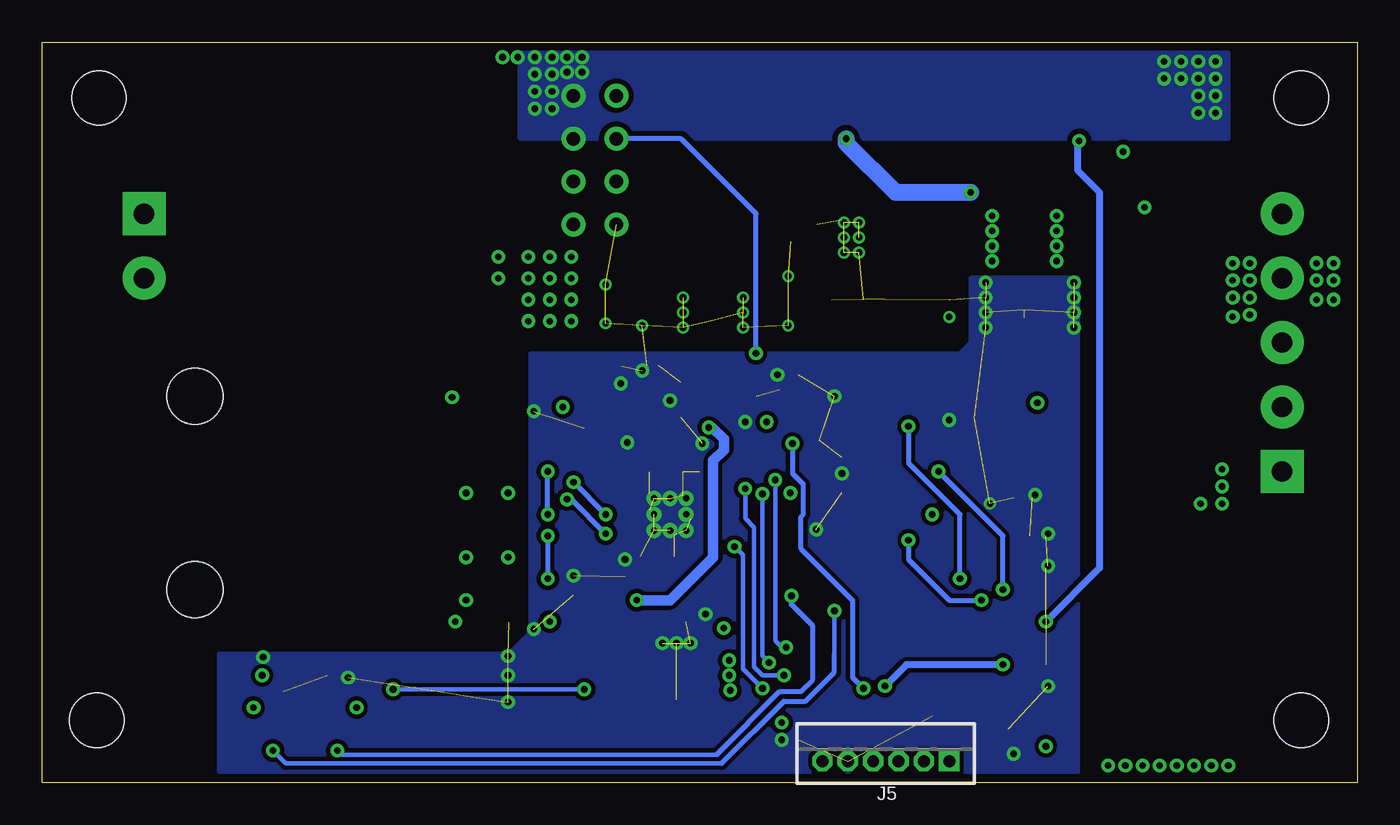
[diagram p5: board, bottom side, seen from below]

Size 77.78 x 43.8 mm. Coordinates in mm from the lower left corner, seen from the top.
Outline: 0,0 77.78,0 77.78,43.8 0,43.8 0,0
Copper layers (1+2*15+16): Top 0.035mm / dielectric 1.5mm / GND 0.035mm / dielectric 0.15mm / VCC 0.035mm / dielectric 0.2mm / Bottom 0.035mm
Design rules "Elecrow_2-layer_eagle_rule *": minimum track width 6mil, minimum drill 12mil, track to track 6mil, track to pad 6mil, pad to pad 6mil, via to via 6mil, smd to smd 0mil, copper to edge 10mil, drill to drill 10mil, minimum pad ring 10mil, minimum via ring 6mil, stop-mask expansion 2mil, vias tented up to drill 100mil, thermal gap 10mil
Holes 3.2 mm at 74.42,40.51 3.3,40.51 3.3,3.68 74.55,3.68
tRestrict: area 70.9,37 to 77.9,44; area -0.2,0.2 to 6.8,7.2; area 70.9,0.2 to 77.9,7.2; area 34.4,36.6 to 36.7,43.4; area 39.9,34.9 to 41.8,40.8; area 36.7,36.6 to 39.9,40.8; area 18.8,35.2 to 18.9,37.2; area 18.9,40.3 to 26.8,42.4; area 21,38.4 to 25,40.3; area 23.1,36.3 to 24.9,38.4; area -0.2,37 to 6.8,44
bRestrict: area 70.9,37 to 77.9,44; area -0.2,37 to 6.8,44; area 70.9,0.2 to 77.9,7.2; area -0.2,0.2 to 6.8,7.2

### Footprints (pad centres in the part's own frame; a part is rotated, then mirrored left to right if it is on the bottom)
0603 = smd 0.762 x 0.965: 1 -0.66,0; 2 0.66,0
2220 = smd 2 x 5.2: P$1 -3,0; P$2 3,0
0805 = smd 1.092 x 1.397: 1 -0.94,0; 2 0.94,0
6032 = smd 2.388 x 2.388: MINUS 2.337,0; PLUS -2.311,0
NFM55P = smd 1 x 5: 1 -2.85,0; 2 2.85,0 | smd 1.5 x 1.5: 3 0,-2.5; 4 0,2.5
1206 = smd 1.143 x 1.702: 1 -1.473,0; 2 1.473,0
PANASONIC-SIZE-CODE-D = smd 3.2 x 1.6: + 2.504,0; - -2.504,0
DO-214AC = smd 1.8 x 1.7: A 1.85,0; K -1.85,0
SOT23-6L = smd 0.55 x 1.2: 1 -0.95,-1.3; 2 0,-1.3; 3 0.95,-1.3; 4 0.95,1.3; 5 0,1.3; 6 -0.95,1.3
SOD80C = smd 1 x 1.7: A 1.65,0; K -1.65,0
M670 = smd 1.1 x 0.8: A 0,0.95; K 0,-0.95
POWERDI123 = smd 0.9 x 1.4: A 1.6,0 | smd 2.2 x 1.4: K -0.95,0
1812L = smd 1.78 x 3.15: 1 -2.615,0; 2 2.615,0
6.1X2.69MM = smd 1.96 x 3.15: 1 -2.455,0; 2 2.455,0
2920L = smd 2 x 5.3: 1 -3.3,0; 2 3.3,0
WE-MLS-10,88MMX5,49MM = drill 0.8 pad 1.422: 1 -3.81,-1.27; 2 -1.27,-1.27; 3 1.27,-1.27; 4 3.81,-1.27; 5 3.81,1.27; 6 1.27,1.27; 7 -1.27,1.27; 8 -3.81,1.27
SO8 = smd 1.524 x 0.61: 1 -2.743,1.905; 2 -2.743,0.635; 3 -2.743,-0.635; 4 -2.743,-1.905; 5 2.743,-1.905; 6 2.743,-0.635; 7 2.743,0.635; 8 2.743,1.905
QFN32_5X5 = smd 0.8 x 0.3: 1 -2.5,1.75; 2 -2.5,1.25; 3 -2.5,0.75; 4 -2.5,0.25; 5 -2.5,-0.25; 6 -2.5,-0.75; 7 -2.5,-1.25; 8 -2.5,-1.75; 17 2.5,-1.75; 18 2.5,-1.25; 19 2.5,-0.75; 20 2.5,-0.25; 21 2.5,0.25; 22 2.5,0.75; 23 2.5,1.25; 24 2.5,1.75 | smd 0.3 x 0.8: 9 -1.75,-2.5; 10 -1.25,-2.5; 11 -0.75,-2.5; 12 -0.25,-2.5; 13 0.25,-2.5; 14 0.75,-2.5; 15 1.25,-2.5; 16 1.75,-2.5; 25 1.75,2.5; 26 1.25,2.5; 27 0.75,2.5; 28 0.25,2.5; 29 -0.25,2.5; 30 -0.75,2.5; 31 -1.25,2.5; 32 -1.75,2.5 | drill 0.381: EP -0.953,0.953; EP1 -0.953,0; EP2 -0.953,-0.953; EP3 0,-0.953; EP4 0.953,-0.953; EP5 0.953,0; EP6 0.953,0.953; EP7 0,0.953 | smd 3.3 x 3.3: PAD 0,0
TQFP32 = smd 1.27 x 0.559: 1 -4.293,2.8; 2 -4.293,2; 3 -4.293,1.2; 4 -4.293,0.4; 5 -4.293,-0.4; 6 -4.293,-1.2; 7 -4.293,-2; 8 -4.293,-2.8; 17 4.293,-2.8; 18 4.293,-2; 19 4.293,-1.2; 20 4.293,-0.4; 21 4.293,0.4; 22 4.293,1.2; 23 4.293,2; 24 4.293,2.8 | smd 0.559 x 1.27: 9 -2.8,-4.293; 10 -2,-4.293; 11 -1.2,-4.293; 12 -0.4,-4.293; 13 0.4,-4.293; 14 1.2,-4.293; 15 2,-4.293; 16 2.8,-4.293; 25 2.8,4.293; 26 2,4.293; 27 1.2,4.293; 28 0.4,4.293; 29 -0.4,4.293; 30 -1.2,4.293; 31 -2,4.293; 32 -2.8,4.293
MS8 = smd 0.35 x 0.89: 1 -0.975,-2.17; 2 -0.325,-2.17; 3 0.325,-2.17; 4 0.975,-2.17; 5 0.975,2.17; 6 0.325,2.17; 7 -0.325,2.17; 8 -0.975,2.17
SO8' = smd 0.61 x 1.524: 1 -1.905,-2.743; 2 -0.635,-2.743; 3 0.635,-2.743; 4 1.905,-2.743; 5 1.905,2.743; 6 0.635,2.743; 7 -0.635,2.743; 8 -1.905,2.743
MCV1,5/2-G-3,81 = drill 1.2 pad 2.54 square: 1 0,0 | drill 1.2 pad 2.54: 2 3.81,0
MCV1,5/5-G-3,81_MOD = drill 1.2 pad 2.54 square: 1 -7.62,0 | drill 1.2 pad 2.54: 2 -3.81,0; 3 0,0; 4 3.81,0; 5 7.62,0
B4B-PH-SM4-TB = smd 1 x 5.5: 1 -3,-1.75; 2 -1,-1.75; 3 1,-1.75; 4 3,-1.75 | smd 1.6 x 3: P$5 -5.4,0.5; P$6 5.4,0.5
B3B-PH-SM4-TB = smd 1 x 5.5: 1 -2,-1.75; 2 0,-1.75; 3 2,-1.75 | smd 1.6 x 3: P$5 -4.4,0.5; P$6 4.4,0.5
B6B-ZR = drill 0.7 pad 1.2 square: 1 0,0 | drill 0.7 pad 1.2 octagon: 2 1.5,0; 3 3,0; 4 4.5,0; 5 6,0; 6 7.5,0
WE-749801108 = smd 0.76 x 4.18: P$1 4.445,0; P$2 3.175,0; P$3 1.905,0; P$4 0.635,0; P$5 -0.635,0; P$6 -1.905,0; P$7 -3.175,0; P$8 -4.445,0 | smd 3.42 x 4.58: P$9 -5.8,15.658; P$10 5.8,15.658 | hole 3.3: -5.71,11.6; 5.71,11.6
73XX = smd 1.6 x 2.2: 1 -3.2,0; 2 3.2,0
WE-SL1 = smd 1.5 x 1: 1 -2.55,-1.25; 3 -2.55,1.25; 4 2.55,1.25; 5 2.55,-1.25
XRCGB = smd 0.75 x 0.7: 1 -0.7,0.45; 2 0.65,-0.55; 3 0.65,0.45; 4 -0.7,-0.55
0207 = smd 1.778 x 2.286: 1 -2.413,0; 2 2.413,0
2512 = smd 3.1 x 3.5: 1 -1.85,0; 2 1.85,0
SOT-23 = smd 0.76 x 0.76: 1 1.15,-0.95; 2 1.15,0.95; 3 -1.15,0
SOT223 = smd 1.5 x 2: 1 -2.3,-3.15; 2 0,-3.15; 3 2.3,-3.15 | smd 3.8 x 2: 4 0,3.15

### Placement (x,y rotation side)
C1  36.2,19.68 90 top
C2  50.16,10.16 270 top
C3  5.71,12.06 180 top
C4  48.9,20.32 90 top
C5  25.4,24.77 180 top
C6  13.34,5.71 90 top
C7  35.56,15.24 90 top
C8  46.35,10.16 90 top
C9  19.68,29.84 270 top
C10  23.5,3.81 90 top
C11  23.5,15.88 0 top
C12  31.75,13.34 270 top
C13  32.38,2.54 0 top
C14  55.24,9.53 0 top
C15  45.72,20.32 90 top
C16  24.13,29.21 90 top
C17  20.32,3.81 90 top
C18  55.24,22.86 0 top
C19  36.2,22.86 180 top
C20  33.02,13.34 270 top
C21  40.01,20.95 90 top
C22  53.34,39.37 180 top
C23  50.8,26.67 270 top
C24  43.81,12.06 0 top
C25  52.07,22.23 270 top
C26  33.66,22.23 270 top
C27  13.97,32.38 0 top
C28  19.05,6.99 0 top
C29  41.27,20.95 90 top
C30  40.64,9.53 0 top
C31  40.64,11.43 0 top
C32  30.48,16.51 90 top
C33  31.75,17.14 90 top
C42  27.3,28.57 180 top
C43  27.3,27.3 0 top
C44  33.66,33.66 90 top
C45  38.1,29.84 90 top
C46  19.68,30.48 90 top
C47  22.23,3.81 90 top
D1  9.53,26.67 270 top
D2  62.23,6.35 90 top
D3  53.34,32.38 270 top
D4  9.53,20.32 90 top
D5  52.7,17.14 90 top
D6  52.7,13.34 90 top
D7  20.32,14.61 270 top
D8  59.05,36.83 270 top
D9  20.32,12.7 270 top
D18  29.21,36.2 0 top
D19  33.02,37.47 90 top
D20  15.88,41.27 0 top
F1  25.4,24.13 180 top
F3  64.14,37.47 270 top
F4  64.14,37.47 90 top
F5  64.14,37.47 90 top
FP3  45.09,36.83 270 top
IC1  25.4,19.68 180 top
IC2  40.64,15.88 90 top
IC3  27.94,8.26 90 top
IC4  13.97,36.2 180 top
IC7  L6902D  [SO8']  29.21,32.38 270 top
J1  71.75,33.66 270 top
J2  4.45,26.04 90 top
J3  41.27,3.17 180 top
J4  53.34,3.17 180 top
J5  24.13,1.27 180 bottom
J6  57.15,17.14 270 top
L1  33.66,15.88 180 top
L2  34.92,19.68 90 top
L3  38.1,22.86 270 top
L4  18.41,3.81 90 top
L5  55.24,10.79 180 top
L6  22.86,38.73 180 top
L7  46.99,20.32 270 top
L8  44.45,10.16 90 top
L9  34.29,12.7 270 top
L12  38.1,38.73 270 top
L13  14.61,20.95 0 top
Q1  31.11,19.68 180 top
Q2  40.64,24.13 180 top
R1  44.45,20.32 90 top
R2  46.99,24.13 270 top
R3  52.7,26.67 270 top
R4  49.53,18.41 180 top
R5  49.53,15.88 0 top
R6  49.53,14.61 180 top
R7  49.53,12.06 0 top
R8  20.32,17.78 90 top
R9  32.38,24.13 180 top
R10  30.48,24.77 90 top
R11  37.47,10.79 270 top
R12  8.89,5.08 90 top
R13  55.88,34.92 90 top
R14  32.38,25.4 0 top
R15  23.5,13.34 180 top
R16  23.5,14.61 180 top
R17  32.38,3.81 0 top
R18  10.16,35.56 90 top
R19  12.06,40.01 0 top
R20  29.84,22.23 270 top
R21  26.8,15.88 180 top
R22  17.78,24.77 180 top
R23  20.32,21.59 90 top
R24  61.59,2.54 90 top
R25  64.14,3.81 90 top
R26  60.33,3.81 90 top
R27  62.87,2.54 90 top
R28  19.05,8.26 0 top
R29  16.51,36.2 270 top
R30  32.38,22.23 270 top
R34  14.61,22.23 0 top
R35  14.61,19.68 0 top
R43  31.75,27.3 180 top
R44  29.21,27.94 270 top
R45  17.78,41.27 270 top
R47  31.75,28.57 0 top
R55  24.13,32.38 270 top
T1  44.45,23.5 90 top
T2  59.05,29.84 270 top

### Tracks (layer width: path | path; a pad name or v marks a point on that pad's centre or on a via)
+1,8V  (via drill 0.4 pad 0.81)
  Top 0.254: IC2.5
  Top 0.305: C30.2 41.3,9.8 C31.2 40.89,11.84 IC2.5 40.89,11.81 41.27,11.43 41.27,10.16 41.91,10.16
  Top 0.406: L3.2 38.1,21.27 v38.35,21.02
  Top 0.61: 41.91,10.16 41.97,10.16 v42.61,10.79
  Top 0.813: L8.1 43.9,9.5 v42.61,10.79
  Bottom 0.61: v42.61,10.79 40.64,10.79 38.1,13.34 38.1,19.05 37.47,19.68 37.47,20.32 38.16,21.02 v38.35,21.02
+3,3V  (via drill 0.4 pad 0.81)
  Top 0.254: R17.2 33.05,3.66 33.15,3.56 | L7.1 v46.99,22.23 R2.2 | R11.2 v37.47,9.14 | v59.18,4.45 59.21,4.47 R26.2 | D2.2 v64.77,6.35 | R25.2 65.25,4.47 v65.28,4.45
  Top 0.305: R55.2 C16.2 24.41,29.59 24.77,29.59 25.27,29.08 25.27,27.18 26.04,26.42 29.97,26.42 30.86,27.3 R43.2 | L9.1 34.29,14.35 33.15,15.49 33.15,15.72 | 33.15,15.72 33.15,16.51 33.53,16.89 v33.53,17.14 | 33.15,15.72 L1.2 | v17.78,33.53 17.78,34.16 18.22,34.61 18.22,40.17 R45.2
  Top 0.406: 33.15,3.56 v34.04,3.56 | L2.2 v34.92,21.34 | L5.2 v52.7,10.79 | v47.75,9.53 46.35,9.53 C8.1
  Top 0.61: R21.2 v25.15,15.88 C11.2 24.16,17.12 23.5,17.78 IC1.8 | R23.2 18.97,22.53 v18.92,22.48 | D5.2 v52.7,17.14 | D6.2 v52.7,13.34 | L4.1 v18.41,2.16
  other vias: 17.78,30.86 17.78,31.75 17.78,32.64 21.59,33.53 21.59,32.64 21.59,31.75 21.59,30.86 37.15,7.24 37.15,6.35 37.08,5.46
  pour Top (isolate 0.305, no thermals): 27.3,32 23.37,32 20.7,34.67 16.26,34.67 16.26,30.61 24.64,30.61 25.4,31.37 27.3,31.37
  pour VCC (isolate 0.254): 53.34,25.4 22.23,25.4 22.23,33.66 16.51,33.66 16.51,0.64 67.31,0.64 67.31,7.62 55.88,7.62 53.34,10.16
  pour Top (no thermals): 38.61,2.29 38.61,7.62 36.77,7.62 36.77,5.02 37.4,4.38 37.4,2.29
+24V  (via drill 0.4 pad 0.81)
  Top 0.305: R14.2 v35.56,25.4
  Bottom 0.305: v35.56,25.4 35.56,33.66 40.01,38.1 FP3.2
  pour Top (no thermals): 44.58,37.08 44.58,43.12 37.08,43.12 37.08,41.27 41.78,41.27 42.29,40.77 42.29,37.08
AVCC
  Top 0.61: IC3.32 23.65,4.62 C10.2 C47.2 20.95,4.47 | 20.95,4.47 L4.2 | C17.2 20.68,4.75 20.95,4.47
BLA
  Top 0.406: 27.38,24.77 27.66,24.48 F1.1
  Top 0.61: 20.32,19.05 IC1.7 23.5,19.05 25.4,20.95 25.4,21.97 27.66,24.48 | 20.32,19.05 17.81,19.05 L13.5 17.14,19.68 R35.2 | R8.2 20.32,19.05 | 27.38,24.77 C5.1
BLA2
  Top 0.61: 15.37,24.64 R22.2 15.54,24.59 R34.2 17.14,22.23 L13.4 19.05,20.32 20.32,20.32 | 20.32,20.32 IC1.6 | R23.1 20.32,20.32
ETH_!CS  (via drill 0.4 pad 0.81)
  Top 0.254: IC2.26 37.61,17.12 36.58,18.16 34.73,18.16 v34.42,17.91 | IC3.12 33.64,7.86 v33.78,8
  Bottom 0.254: v33.78,8 34.04,8 34.42,8.38 v34.42,17.91
ETH_!INT
  Top 0.254: IC3.13 32.34,8.76 34.67,8.76 37.36,11.46 R11.1 37.69,11.68 38.86,11.68 39.88,12.7 39.88,13.36 IC2.3
ETH_MISO  (via drill 0.4 pad 0.81)
  Top 0.254: IC2.27 36.97,16.62 v36.2,17.4 | v33.91,6.35 32.33,6.35 IC3.10
  Bottom 0.254: v36.2,17.4 36.2,15.62 35.69,15.11 35.69,6.86 35.18,6.35 v33.91,6.35
ETH_MOSI  (via drill 0.4 pad 0.81)
  Top 0.254: v35.18,5.59 32.37,5.59 IC3.9 | v36.83,13.97 37.47,14.61 38.12,14.61 IC2.31
  Bottom 0.254: v35.18,5.59 36.32,6.73 36.32,13.46 v36.83,13.97
ETH_PME
  Top 0.254: IC3.14 33.97,9.46 36.83,12.32 38.86,12.32 39.39,12.85 IC2.2
ETH_RESET
  Top 0.254: R2.1 45.55,24.79 T1.1
ETH_RXM  (via drill 0.4 pad 0.81)
  Top 0.254: IC2.12 44.2,15.62 v44.45,15.88
  Top 0.305: J6.P$6 55.12,19.05 54.16,18.09 D5.3 D5.4 50.16,18.09 49.97,18.09 49.4,17.53 47.24,17.53 46.99,17.78 v46.35,17.78
  Top 0.406: R4.1 50.16,18.41 50.16,18.09
  Bottom 0.305: v44.45,15.88 v46.35,17.78
ETH_RXP  (via drill 0.4 pad 0.81)
  Top 0.254: IC2.11 44.06,15.12 v44.45,14.73
  Top 0.305: J6.P$3 54.96,15.24 D5.1 D5.6 50.16,16.2 | 50.16,16.2 49.97,16.2 49.15,17.02 46.99,17.02 v46.74,16.76 | R5.2 50.19,16.17 50.16,16.2
  Bottom 0.254: v44.45,14.73 44.58,14.73
  Bottom 0.305: v46.74,16.76 46.48,16.76 v44.45,14.73
ETH_SCK  (via drill 0.4 pad 0.81)
  Top 0.254: IC2.28 36.83,16.12 36.32,16.64 35.56,16.64 v35.18,17.08 | v34.8,7.11 32.29,7.11 IC3.11
  Bottom 0.254: v35.18,17.08 35.18,7.49 v34.8,7.11
ETH_TXM
  Top 0.305: J6.P$2 55.24,13.97 54.86,14.35 54.07,14.35 D6.3 D6.4 51.34,14.35 50.16,14.35 | IC2.15 45.1,17.12 45.97,16.26 45.97,14.1 46.48,13.59 49.4,13.59 50.16,14.35 | 50.16,14.35 50.16,14.58 R6.1
ETH_TXP
  Top 0.305: J6.P$1 55.12,12.7 54.74,12.32 54.07,12.32 D6.1 D6.6 50.16,12.38 | 50.16,12.38 49.97,12.38 49.28,13.08 46.1,13.08 45.34,13.84 45.34,16.13 44.83,16.64 43.15,16.64 IC2.14 | R7.2 50.19,12.36 50.16,12.38
GND  (via drill 0.4, 0.4 pad 0.81)  (77 unrouted)
  Top 0.254: 39.89,17.03 IC2.EP6 | 41.89,17.12 IC2.EP4 | 40.39,14.67 IC2.EP1 | IC2.8 42.39,12.83 C24.1 | 38.89,18.51 IC2.24 38.39,18.38 36.7,20.07 36.47,20.07 C1.2 | C29.2 41.27,21.97 v40.64,22.61 | C21.2 40.01,21.97 v40.64,22.61 | Q2.3 39.99,23.26 v40.64,22.61 | Q2.4 41.99,24.68 v42.29,24.38 | IC2.22 39.89,19.29 39.62,19.56 39.24,19.56 v38.73,20.07 | IC2.18 41.89,18.84 v43.18,20.13 44.16,21.11 R1.2 | T1.2 43.5,23.68 v43.56,23.62 | C33.2 30.96,17.8 v30.48,18.29 | C32.2 v30.48,18.29 | Q1.3 30.46,18.3 v30.48,18.29 | IC2.13 41.84,16.12 IC2.EP3 | C7.2 35.84,15.62 IC2.29 39.44,15.62 IC2.EP7 IC2.PAD | D2.1 65.15,5.4 65.66,5.91 65.66,7.05 65.34,7.37 64.77,7.37 v64.71,7.43 64.58,7.3 D2.3 | C19.2 35.53,22 v36.2,21.34
  Top 0.305: v24.13,27.56 24.13,28.57 | v34.04,2.54 C13.2 | D9.K 18.41,12.7 v18.29,12.83 | D7.K 18.41,14.61 v18.29,14.73 | IC2.4 40.39,11.84 C31.1 39.98,9.8 C30.1 | D2.5 59.82,6.35 v59.69,6.22 | R20.1 30.9,22.89 v30.92,22.86 | R9.1 v34.29,24.13 34.16,24 34.16,23.24 33.81,22.89 C26.1 | D20.K 15.88,40.26 17.46,38.67 17.46,35.88 17.08,35.5 16.55,35.5 R29.2 | R1.2 C15.2
  Top 0.406: R29.2 16.51,33.21 16,32.7 16,30.35 v16.76,29.59 | C1.2 v36.2,21.34 | C20.1 C12.1 | C12.1 30.63,13.99 29.97,13.34 29.97,12.58 IC3.18 | C28.1 18.39,5.82 v18.29,5.71 | C8.2 v46.35,12.26 | v32,14.99 32,14.25 C12.1
  Top 0.61: IC3.1 24.92,3.96 24.13,3.17 23.5,3.17 | 23.5,3.17 22.23,3.17 | 22.23,3.17 20.62,3.17 C17.1 v20.32,1.71 | C47.1 22.23,3.17 | C10.1 23.5,3.17 | R8.1 19.23,16.84 v19.05,17.02 | IC1.5 24,21.59 v24.13,21.46 | C11.1 22.35,15.88 v21.72,16.51 | v43.31,13.21 43.31,12.22 C24.1 | C4.2 48.9,21.78 v48.7,21.97 | C2.2 49.12,9.5 v48.7,9.08 | C30.1 38.99,9.53 v38.54,9.97
  Top 0.813: D18.A 30.81,35.89 30.48,35.56 30.48,33.27 v30.35,33.15
  Top 1.016: IC7.7 34.04,33.02 35.05,32 33.53,32 33.53,32.59 C44.1 | FP3.3 FP3.4
  other vias: 30.35,32.26 30.35,31.37 29.46,31.37 29.46,32.26 29.46,33.15 39.88,27.81 39.88,28.7 16.76,26.92 16.76,27.81 21.97,29.59 21.97,28.7 21.97,27.81 21.97,26.92 16.76,28.7 39.88,26.92 36.32,27.81 36.32,28.7 36.32,26.92 44.45,27.18 44.45,29.46 42.29,27.05 33.66,29.97 33.66,27.05 50.23,4.76 50.23,6.35 50.23,7.49 39.43,8.26 41.08,8.26 40.26,8.26
  pour Top (isolate 0.305, rank 2): 45.09,26.67 15.24,26.67 15.24,34.29 45.09,34.29
  pour GND (isolate 0.254): 48.9,25.4 22.23,25.4 22.23,27.3 16.51,27.3 16.51,0.64 67.31,0.64 67.31,7.62 49.53,7.62 48.9,8.26
  pour Top (rank 2, no thermals): 22.86,26.67 16.51,26.67 16.51,29.97 22.86,29.97
  pour GND (isolate 0.305): 16.51,26.67 16.64,33.27 45.21,33.27 45.09,26.67
  pour Top (isolate 0.254, rank 3): 16.51,0.64 16.51,29.84 22.86,29.84 22.86,26.04 23.5,25.4 48.9,25.4 48.9,8.89 50.16,7.62 67.31,7.62 67.31,0.64
  pour Bottom (isolate 0.254, rank 3): 16.51,0.64 16.51,29.84 22.86,29.84 22.86,26.04 23.5,25.4 48.9,25.4 48.9,8.89 50.16,7.62 67.31,7.62 67.31,0.64
GNDA  (via drill 0.4 pad 0.81)
  Top 0.406: v12.57,34.04 12.45,34.04 12.38,33.97 12.94,33.97 IC4.5 | IC4.3 13.64,37.54 v13.84,37.34
  Top 0.61: D6.5 v50.23,13.34 | D5.5 v50.23,17.14 | C14.1 v53.34,9.53 | C18.1 53.59,22.86 v53.53,22.8
  Top 1.27: R3.1 C23.1
  other vias: 47.75,27.3 46.48,27.3 47.75,29.84 46.48,29.84 47.75,28.57 46.48,28.57 50.8,29.84 47.75,31.11 46.48,31.11 50.8,31.11 6.35,29.72 6.35,28.7 6.35,27.69 7.37,27.56 7.37,28.7 7.37,29.72 7.37,30.73 6.35,30.73 2.41,30.73 1.4,30.73 2.41,29.72 1.4,29.72 2.41,28.57 1.4,28.57 8,18.54 8,17.53 8,16.51 9.27,16.51 7.62,1.02 8.64,1.02 9.65,1.02 10.67,1.02 11.68,1.02 12.7,1.02 13.72,1.02 14.73,1.02 49.02,27.3 49.02,29.84 49.02,28.57 49.02,31.11
  pour Top (isolate 0.254, no thermals): 58.42,26.67 45.72,26.67 45.72,36.2 51.44,36.2 52.07,36.83 52.07,43.18 53.98,43.18 53.98,28.45 56.64,28.45
  pour GND (isolate 0.305, rank 3, no thermals): 76.83,8.89 76.83,36.2 69.85,36.2 69.85,43.18 7.62,43.18 7.62,36.83 1.27,36.83 1.27,6.99 6.99,6.99 6.99,0.64 15.24,0.64 15.24,34.29 46.35,34.29 46.35,26.67 50.16,26.67 50.16,8.89
  pour Top (isolate 0.305, no thermals): 4.45,5.08 15.88,5.08 15.88,0.64 4.45,0.64
  pour Top (no thermals): 1.27,31.11 13.97,31.11 13.97,26.67 6.35,26.67 5.08,27.94 1.27,27.94
  pour Top (no thermals): 7.62,19.05 10.29,19.05 10.29,15.88 7.62,15.88
I_LED  (via drill 0.4 pad 0.81)
  Top 0.406: R28.2 C28.2 v20.95,6.99 | v27.94,5.71 28.32,5.33 28.32,3.98 IC3.5
  Bottom 0.406: v20.95,6.99 26.67,6.99 v27.94,5.71
I_LED_SHUNT+  (via drill 0.4 pad 0.81)
  Top 0.254: 14.29,34.23 14.35,34.29
  Top 0.406: R18.2 11.29,37.54 11.75,37.08 11.75,36.45 12.45,35.75 15.05,35.75 15.56,35.24 15.56,33.4 15.18,33.02 14.61,33.02 14.29,33.33 IC4.7 | 14.35,34.29 14.35,34.04 | 14.35,34.04 14.35,32.94 14.91,32.94 C27.2 | 14.35,34.04 14.34,34.02 IC4.7 | 14.29,34.23 IC4.7
  other vias: 47.62,39.88 48.64,39.88 48.64,40.89 47.62,40.89 47.62,41.91 48.64,41.91 47.62,42.93 48.64,42.93 10.41,42.67 8.38,39.62 10.41,41.66 9.4,39.62 9.4,40.64 8.38,40.64 8.38,41.66 9.4,41.66 8.38,42.67 9.4,42.67 11.43,42.67 11.43,41.66 45.85,42.04 46.74,42.04 46.74,42.93 45.85,42.93 50.55,42.93 49.66,42.93
  pour Top (no thermals): 45.59,37.21 50.8,37.21 50.8,43.12 45.59,43.12
  pour VCC (isolate 0.305, no thermals): 49.53,38.1 7.62,38.1 7.62,43.18 49.53,43.18
  pour Top (isolate 0.305, no thermals): 9.02,36.7 7.62,38.1 7.62,43.12 11.68,43.12 11.68,36.7
  pour Bottom (isolate 0.305, no thermals): 49.53,38.1 7.62,38.1 7.62,43.18 49.53,43.18
LED_GREEN
  Top 0.305: IC3.24 25.14,12.96 24.51,13.59 24.41,13.59 R15.1
LED_RED
  Top 0.305: IC3.23 25.94,13.43 24.77,14.61 R16.1
N$1
  Top 0.254: IC2.17 43.31,19.3 44.09,19.3 R1.1
N$2
  pour Top (isolate 0.305, no thermals): 10.16,6.35 1.27,6.35 1.27,20.32 6.35,20.32 6.35,9.53 7.62,8.26 10.16,8.26
N$3
  Top 0.254: IC2.19 41.4,18.39 41.4,19.05 42.29,19.94 42.29,20.45 43.94,22.1 44.2,22.1 T1.3
N$4
  Top 0.254: L1.1 34.48,15.71 34.48,15.3 35.2,14.58 C7.1 36.1,15.12 IC2.30
N$5
  Top 0.254: IC2.25 37.87,17.62 37.85,17.65 37.72,17.65 36.58,18.8 36.42,18.8 C1.1
  Top 0.406: L2.1 C1.1
N$6
  Top 0.406: 22.15,24.77 F1.2 22.86,24.2 22.86,24.77
  Top 0.61: R22.1 22.15,24.77 C5.2
N$7
  Top 0.406: D3.K 55.83,34.03 R13.1 55.91,33.96 T2.1
N$8
  Top 0.406: IC4.6 13.64,33 C27.1
N$9
  pour Top (no thermals): 10.79,7.62 10.79,8.89 10.16,9.53 7.62,9.53 7.62,14.61 10.79,14.61 15.88,9.53 15.88,7.62
N$10
  Top 0.813: J6.P$8 52.91,21.59 C25.2
N$11
  Top 0.305: R15.2 21.91,13.34 D9.A
N$12
  Top 0.305: R16.2 D7.A
N$13
  Top 0.254: IC2.20 40.89,19.93 41.25,20.3 | 41.25,20.3 42.04,21.08 42.04,22.98 Q2.1 | C29.1 41.25,20.3
N$14
  Top 0.254: IC3.20 28.34,13.99 29.97,15.62 29.97,15.75 | 29.97,15.75 29.97,16.26 29.72,16.51 29.72,19.68 29.97,19.94 30.17,19.94 Q1.2 | C32.1 30.07,15.85 29.97,15.75
N$15
  pour Top (no thermals): 76.83,32.38 68.58,32.38 67.94,33.02 62.23,33.02 61.59,33.66 61.59,36.2 76.83,36.2
N$16
  Top 0.254: IC3.19 29.14,13.77 30.1,14.73 30.73,14.73 31.75,15.75 C33.1 31.77,16.48 31.81,16.45 32.64,17.27 32.64,18.41 Q1.1
N$17
  Top 0.305: R14.1 31.77,25.4 R10.2
N$18  (via drill 0.4 pad 0.81)
  Top 0.406: IC4.4 12.99,36.92 13.46,36.45 15.62,36.45 15.88,36.7 16.36,36.7 R29.1 16.51,37.91 v16.45,37.97 | v18.41,9.53 18.41,8.28 R28.1
  Bottom 0.406: v18.41,9.53 15.24,12.7 15.24,34.92 16.51,36.2 16.51,37.91 v16.45,37.97
N$19
  Top 0.406: R13.2 55.88,39.05 C22.1
  pour Top (no thermals): 55.24,36.83 57.15,36.83 57.78,37.47 66.67,37.47 66.67,43.18 55.24,43.18
N$20
  Top 0.254: IC2.16 44.3,17.62 45.72,19.05 C15.1 L7.2
N$21
  Top 0.305: R10.1 31.7,24.11 R9.2 31.73,23.55 R30.1
N$22  (via drill 0.4 pad 0.81)
  Top 0.254: 60.86,5.33 61.59,4.7 R24.2 61.54,3.15 R26.1 61.57,3.15 61.59,3.17 61.59,4.51 | D2.6 60.87,5.46 55.88,5.46 J4.1 55.34,5.3 55.56,5.52 v57.02,5.52 | v45.72,5.52 44.87,5.52 J3.1
  Top 0.305: 60.86,5.33 D2.6
  Bottom 0.254: v57.02,5.52 v45.72,5.52
N$23
  Top 0.254: IC2.21 40.39,19.68 39.88,20.19 | 39.88,20.19 39.24,20.83 39.24,24.13 39.5,24.38 39.69,24.38 Q2.2 | C21.1 39.98,20.3 39.88,20.19
N$24
  Top 0.254: 62.23,6.6 62.23,4.19 62.87,3.56 R27.2 62.92,3.15 R25.1 | 60.87,7.24 57.53,7.24 56.52,8.26 53.98,8.26 53.34,7.62 | 53.34,7.62 J4.2 | J3.2 42.27,7.35 43.18,8.26 52.7,8.26 53.34,7.62
  Top 0.305: D2.4 60.87,7.24 61.59,7.24 62.23,6.6
N$25
  Top 0.254: 59.05,17.78 59.05,16.51
  Top 0.305: J6.P$5 59.05,17.78 59.94,18.67 59.94,22.61 59.69,22.86 C18.2 | J6.P$4 59.05,16.51 59.18,16.51 59.94,15.75 59.94,11.56 59.18,10.79 L5.1
  Top 0.406: L5.1 C14.2
N$26  (via drill 0.4 pad 0.81)
  Top 0.305: R6.2 v47.88,14.61 | v47.88,12.06 R7.1
  Top 0.61: R7.1 48.87,11.46 49.53,10.79 50.14,10.79 C2.1
  Bottom 0.305: v47.88,14.61 v47.88,12.06
N$27
  Top 0.254: IC2.9 43.66,14.12 44.45,13.34 44.45,12.09 C24.2 | 44.45,12.04 44.48,12.04
  Top 0.406: L8.2 44.45,12.04 C24.2
N$28
  pour Top (no thermals): 76.83,31.11 67.82,31.11 67.06,31.88 61.47,31.88 60.33,33.02 60.33,34.92 59.69,35.56 58.42,35.56 57.66,34.8 57.66,31.11 57.02,30.48 54.99,30.48 54.99,29.21 57.02,29.21 60.07,26.16 76.83,26.16
N$29  (via drill 0.4 pad 0.81)
  Top 0.305: R5.1 v47.88,15.88 | v47.88,18.41 R4.2 C4.1
  Bottom 0.305: v47.88,15.88 v47.88,18.41
N$30
  Top 0.254: IC4.2 IC4.1
  Top 0.406: IC4.2 14.29,39.05 13.34,40.01 R19.2
N$38
  Top 0.61: R43.1 R47.2 32.41,30.48 IC7.5
N$39  (via drill 0.4 pad 0.81)
  Top 1.016: D19.A 31.19,39.06 v30.23,38.1 | v22.86,34.92 22.48,34.92 22.23,35.18
  Bottom 1.016: v30.23,38.1 30.23,37.85 27.3,34.92 v22.86,34.92
  pour Top (no thermals): 27.56,32.83 23.75,32.83 19.3,37.34 18.92,37.72 18.92,39.88 20.45,39.88 20.45,38.23 25.27,33.4 27.56,33.4
N$59
  pour Top (no thermals): 25.78,34.04 25.27,34.54 25.27,39.75 26.92,39.75 26.92,38.35 27.81,37.47 28.57,37.47 28.57,34.54 28.07,34.04
N$62
  Top 0.61: IC7.4 26.64,30.48 C42.2 C43.1
N$63
  Top 0.61: R44.2 29.21,27.3 C43.2
N$65
  Top 0.305: R45.1 16.16,41.94 D20.A
N$67
  pour Top (no thermals): 39.37,31.11 39.37,36.2 32.51,36.2 31.5,34.92 31.5,34.04 34.54,34.04 36.2,32.38 36.2,31.11
PDI_CLK
  Top 0.305: J5.6 31.63,2.63 | 31.63,3.71 R17.1 | 31.63,3.71 30.99,3.71 IC3.8 | 31.63,3.71 31.63,2.63 | 31.63,2.63 C13.1
PDI_DATA
  Top 0.254: J5.2 25.63,1.5 26.42,2.29 29.08,2.29 29.97,3.17 29.97,3.93 IC3.7
PE
  pour Top (no thermals): 76.83,8.89 76.83,25.4 50.16,25.4 50.16,23.5 52.96,23.5 53.34,23.88 60.71,23.88 60.71,8.89
RS485_A
  Top 0.61: 9.53,24.77 10.16,24.77 12.05,22.87 L13.3 13.64,22.2 R34.1 | 9.53,24.77 5.71,24.77 J2.3 | D1.A 9.53,24.77
RS485_B
  Top 0.406: 10.11,22.23 D4.A
  Top 0.61: J2.2 9.47,22.23 D4.A 10.11,21.59 10.16,21.59 L13.1 13.64,19.7 R35.1
RS485_ENA  (via drill 0.4 pad 0.81)
  Top 0.254: IC1.2 28.57,19.05
  Top 0.305: v24.77,18.41 25.4,19.05 IC1.2 IC1.3 28.6,20.32 R20.2 | IC3.27 23.58,9.53 22.23,9.53 20.95,10.79 v20.95,11.43
  Bottom 0.305: v20.95,11.43 20.95,14.61 v24.77,18.41
RS485_RX  (via drill 0.4 pad 0.81)
  Top 0.305: IC1.1 28.14,16.05 R21.1 27.96,15.85 28.19,15.62 27.81,15.62 v26.54,14.35 | IC3.26 23.61,10.29 22.86,10.29 22.23,10.92 v22.23,10.79
  Bottom 0.305: v22.23,10.79 24.13,10.79 26.54,13.21 v26.54,14.35
RS485_TX  (via drill 0.4 pad 0.81)
  Top 0.305: v23.5,12.06 23.5,11.21 IC3.25 | IC1.4 27.05,21.59 v26.54,21.08
  Bottom 0.305: v23.5,12.06 23.5,15.88 26.54,18.92 v26.54,21.08
SCL/RXD_EXT  (via drill 0.4 pad 0.81)
  Top 0.254: IC3.15 31.02,10.26 v30.92,10.16 | v64.14,1.91 62.89,1.91 R27.1
  Bottom 0.254: v30.92,10.16 30.92,7.62 | 37.59,1.14 63.37,1.14 v64.14,1.91
  Bottom 0.305: 37.59,1.14 33.91,4.83 32.64,4.83 30.92,6.54 30.92,7.62
SDA/TXD_EXT  (via drill 0.4 pad 0.81)
  Top 0.254: IC3.16 32.63,11.05 v33.47,11.05 | v60.33,1.91 61.57,1.91 R24.1
  Bottom 0.254: 37.85,1.65 60.07,1.65 v60.33,1.91
  Bottom 0.305: v33.47,11.05 33.47,10.54 32.19,9.27 32.19,6.1 32.89,5.4 34.16,5.4 37.85,1.71 37.85,1.65
U_VIN  (via drill 0.4 pad 0.81)
  Top 0.305: C26.2 R30.2 33.43,21.57 33.66,21.34 33.78,21.46 33.53,21.46 33.4,21.34 v33.4,20.07 | v29.21,5.59 29.21,4.03 IC3.6
  Bottom 0.305: v33.4,20.07 33.4,18.29 32.77,17.65 32.77,15.88 32.89,15.75 32.89,13.84 29.84,10.79 29.84,6.22 v29.21,5.59
V_LED
  Top 0.305: 11.16,34.02 10.79,33.66 10.21,33.66 R18.1
  Top 0.406: IC4.8 14.92,34.02 14.92,34.67 14.54,35.05 12.19,35.05 11.16,34.02
  pour Top (no thermals): 1.14,31.75 11.68,31.75 11.68,34.29 11.56,34.42 9.02,34.42 6.6,36.83 1.14,36.83
VCC
  Top 0.406: IC3.17 30.74,12.69 30.73,12.7 31.75,12.7 | 31.75,12.7 32.99,12.7 L9.2 C20.2 | C12.2 31.75,12.7
VDD_D18
  Top 0.254: IC2.23 39.39,18.9 39.18,19.11 38.54,19.11 37.21,20.45 37.21,23.05 | 37.21,23.05 37.53,23.37 37.95,23.37 L3.1 | 37.21,23.05 36.85,23.05 C19.1

### Text on the board
tPlace: ArtNet DMX Controller V1 | C.Mösl/2015